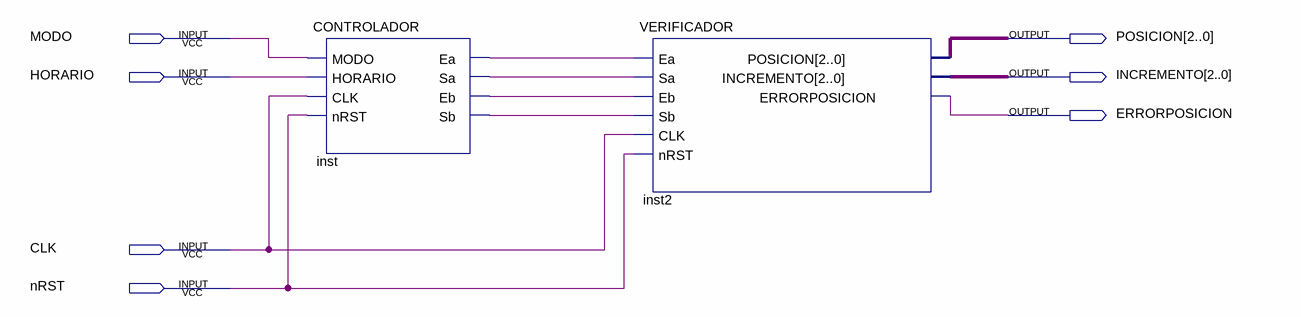
[diagram p0: schematic sheet]
// Quartus schematic MOTORPAP.bdf as structural Verilog: 2 symbols, 7 pins
module MOTORPAP (
  input  MODO,
  input  HORARIO,
  input  CLK,
  input  nRST,
  output [2:0] POSICION,
  output [2:0] INCREMENTO,
  output ERRORPOSICION
);

  wire inst_ea, inst_eb, inst_sa, inst_sb;

  CONTROLADOR inst (
    .MODO(MODO), .HORARIO(HORARIO), .CLK(CLK), .nRST(nRST), .Ea(inst_ea), .Sa(inst_sa), .Eb(inst_eb),
    .Sb(inst_sb));
  VERIFICADOR inst2 (
    .Ea(inst_ea), .Sa(inst_sa), .Eb(inst_eb), .Sb(inst_sb), .CLK(CLK), .nRST(nRST), .POSICION(POSICION),
    .INCREMENTO(INCREMENTO), .ERRORPOSICION(ERRORPOSICION));
endmodule
